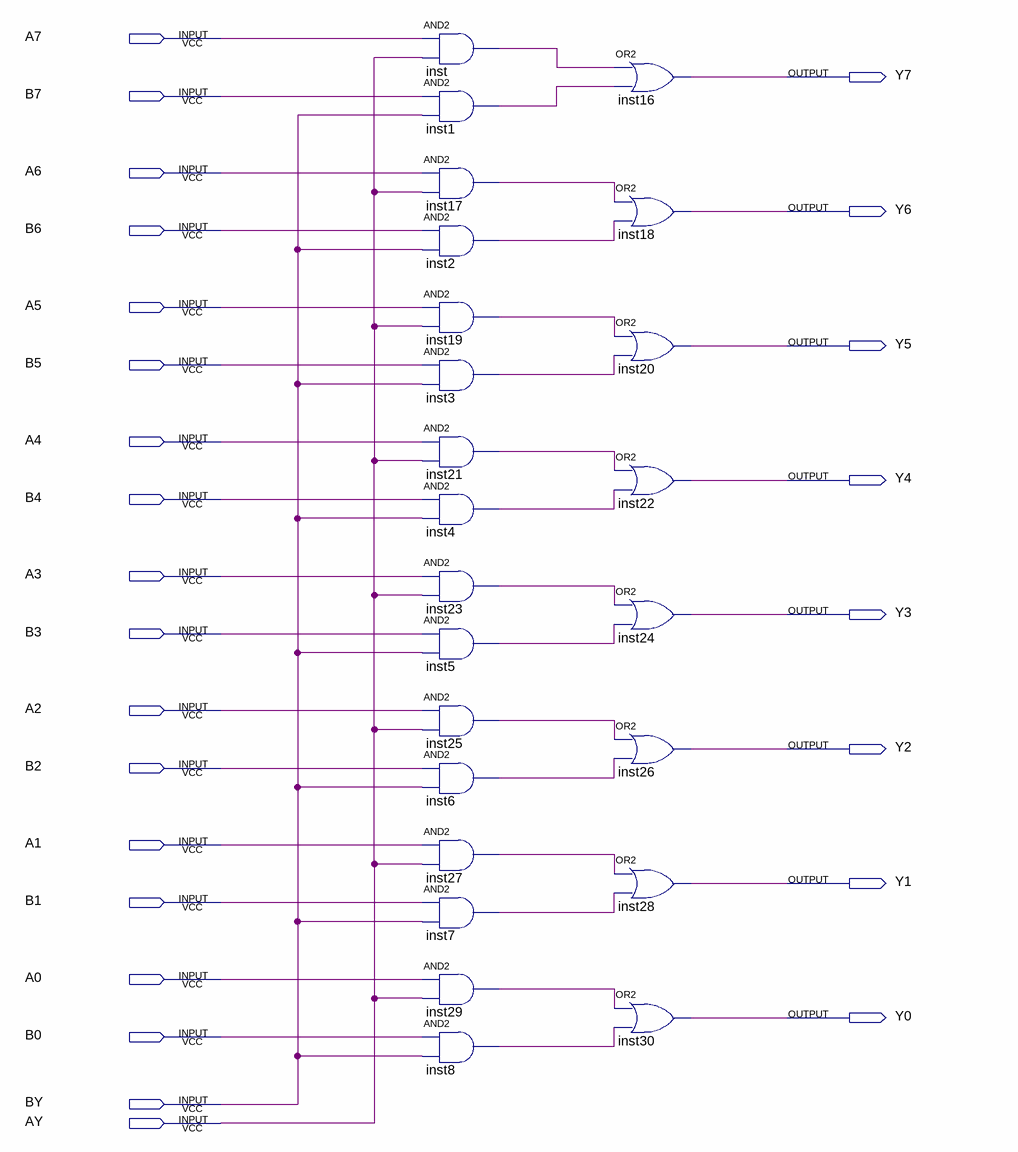
[diagram p0: schematic sheet]
// Quartus schematic multiplexer2_1.bdf as structural Verilog: 24 symbols, 26 pins
module multiplexer2_1 (
  input  A7,
  input  B7,
  input  A6,
  input  B6,
  input  A5,
  input  B5,
  input  A4,
  input  B4,
  input  A3,
  input  B3,
  input  A2,
  input  B2,
  input  A1,
  input  B1,
  input  A0,
  input  B0,
  input  BY,
  input  AY,
  output Y7,
  output Y6,
  output Y5,
  output Y4,
  output Y3,
  output Y2,
  output Y1,
  output Y0
);

  wire inst1_out, inst2_out, inst3_out, inst4_out, inst5_out, inst6_out, inst7_out, inst8_out, inst17_out,
       inst19_out, inst21_out, inst23_out, inst25_out, inst27_out, inst29_out, inst_out;

  and inst (inst_out, A7, AY);
  and inst1 (inst1_out, B7, BY);
  and inst17 (inst17_out, A6, AY);
  and inst2 (inst2_out, B6, BY);
  and inst19 (inst19_out, A5, AY);
  and inst3 (inst3_out, B5, BY);
  and inst21 (inst21_out, A4, AY);
  and inst4 (inst4_out, B4, BY);
  and inst23 (inst23_out, A3, AY);
  and inst5 (inst5_out, B3, BY);
  and inst25 (inst25_out, A2, AY);
  and inst6 (inst6_out, B2, BY);
  and inst27 (inst27_out, A1, AY);
  and inst7 (inst7_out, B1, BY);
  and inst29 (inst29_out, A0, AY);
  and inst8 (inst8_out, B0, BY);
  or inst16 (Y7, inst_out, inst1_out);
  or inst18 (Y6, inst17_out, inst2_out);
  or inst20 (Y5, inst19_out, inst3_out);
  or inst22 (Y4, inst21_out, inst4_out);
  or inst24 (Y3, inst23_out, inst5_out);
  or inst26 (Y2, inst25_out, inst6_out);
  or inst28 (Y1, inst27_out, inst7_out);
  or inst30 (Y0, inst29_out, inst8_out);
endmodule
